# EAGLE design Schaltplan (EAGLE 5.10)
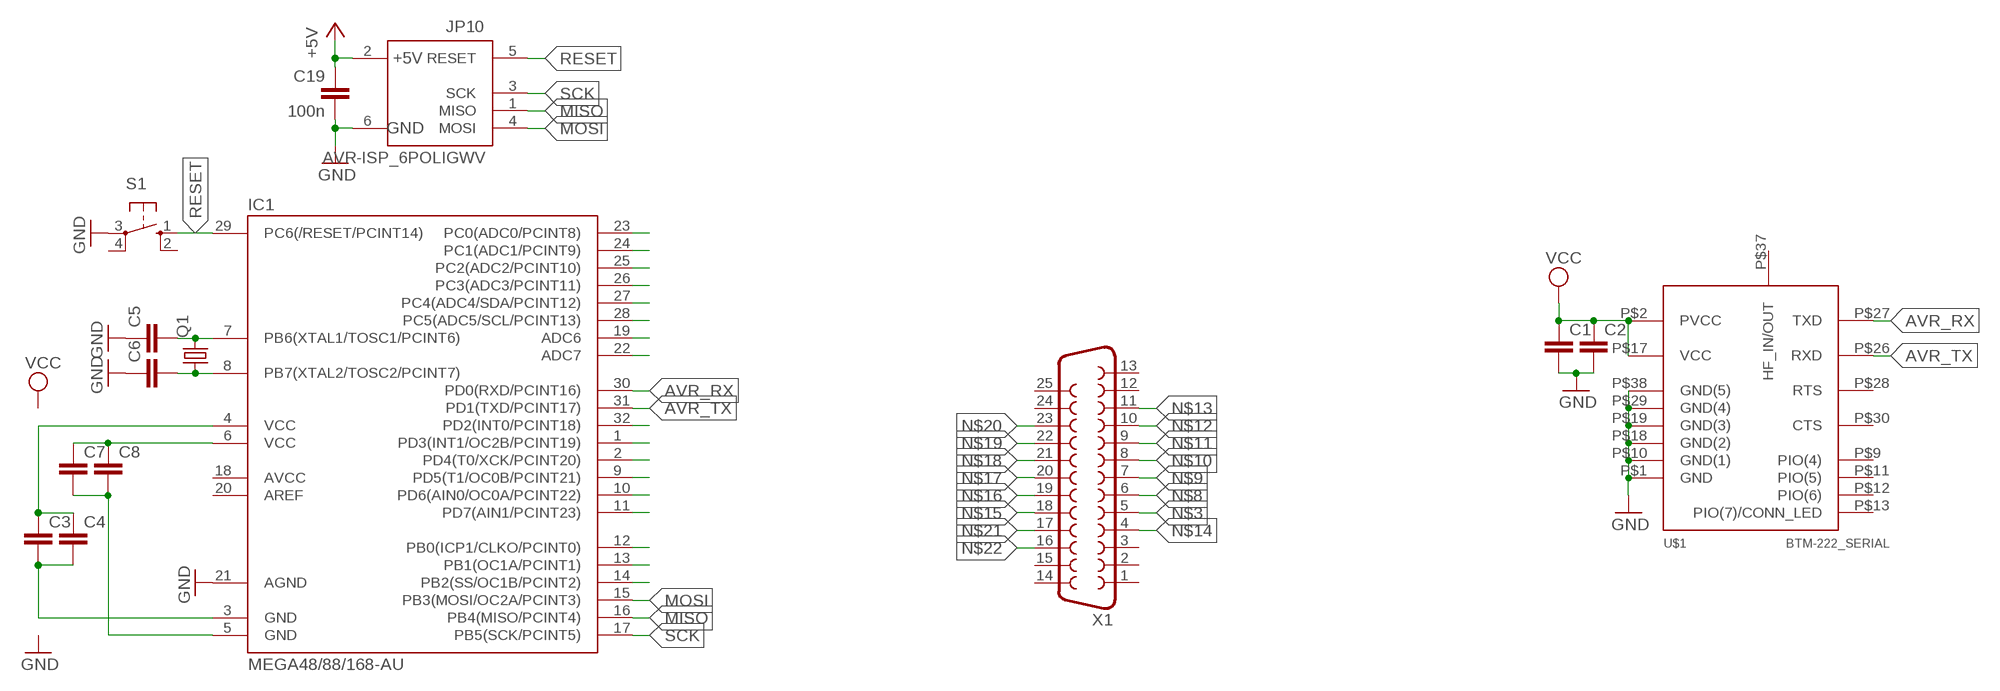
[diagram p0: schematic, sheet 1]

## Parts
C1  C-EUC0805  [C0805]
C2  C-EUC0805  [C0805]
C3  C-EUC0805  [C0805]
C4  C-EUC0805  [C0805]
C5  C-EUC0805  [C0805]
C6  C-EUC0805  [C0805]
C7  C-EUC0805  [C0805]
C8  C-EUC0805  [C0805]
C19  100n  C-EU025-024X044  [C025-024X044]
IC1  MEGA48/88/168-AU  [TQFP32-08]
JP10  AVR-ISP_6POLIGWV  [ML6L]
Q1  CRYSTALHC49U-V  [HC49U-V]
S1  10-XX  [B3F-10XX]
U$1  BTM-222_SERIAL  [BTM-222]
X1  F25VP  [F25VP]

## Nets
+5V: C19.1 JP10.2(+5V)
AVR_RX: IC1.30(PD0(RXD/PCINT16)) U$1.P$27(TXD)
AVR_TX: IC1.31(PD1(TXD/PCINT17)) U$1.P$26(RXD)
GND: C1.2 C2.2 C5.1 C6.1 C19.2 IC1.21(AGND) JP10.6(GND) S1.3(P) U$1.P$1(GND) U$1.P$10(GND(1)) U$1.P$18(GND(2)) U$1.P$19(GND(3)) U$1.P$29(GND(4)) U$1.P$38(GND(5))
MISO: IC1.16(PB4(MISO/PCINT4)) JP10.1(MISO)
MOSI: IC1.15(PB3(MOSI/OC2A/PCINT3)) JP10.4(MOSI)
N$1: C5.2 IC1.7(PB6(XTAL1/TOSC1/PCINT6)) Q1.2
N$2: C6.2 IC1.8(PB7(XTAL2/TOSC2/PCINT7)) Q1.1
N$3: X1.5
N$4: C7.2 C8.2 IC1.5(GND)
N$5: C7.1 C8.1 IC1.6(VCC)
N$6: C3.2 C4.2 IC1.3(GND)
N$7: C3.1 C4.1 IC1.4(VCC)
N$8: X1.6
N$9: X1.7
N$10: X1.8
N$11: X1.9
N$12: X1.10
N$13: X1.11
N$14: X1.4
N$15: X1.18
N$16: X1.19
N$17: X1.20
N$18: X1.21
N$19: X1.22
N$20: X1.23
N$21: X1.17
N$22: X1.16
N$23: IC1.23(PC0(ADC0/PCINT8))
N$24: IC1.24(PC1(ADC1/PCINT9))
N$25: IC1.25(PC2(ADC2/PCINT10))
N$26: IC1.26(PC3(ADC3/PCINT11))
N$27: IC1.27(PC4(ADC4/SDA/PCINT12))
N$28: IC1.28(PC5(ADC5/SCL/PCINT13))
N$29: IC1.19(ADC6)
N$30: IC1.22(ADC7)
N$31: IC1.32(PD2(INT0/PCINT18))
N$32: IC1.1(PD3(INT1/OC2B/PCINT19))
N$33: IC1.2(PD4(T0/XCK/PCINT20))
N$34: IC1.9(PD5(T1/OC0B/PCINT21))
N$35: IC1.10(PD6(AIN0/OC0A/PCINT22))
N$36: IC1.11(PD7(AIN1/PCINT23))
N$37: IC1.12(PB0(ICP1/CLKO/PCINT0))
N$38: IC1.13(PB1(OC1A/PCINT1))
N$39: IC1.14(PB2(SS/OC1B/PCINT2))
RESET: IC1.29(PC6(/RESET/PCINT14)) JP10.5(RESET) S1.1(S)
SCK: IC1.17(PB5(SCK/PCINT5)) JP10.3(SCK)
VCC: C1.1 C2.1 U$1.P$2(PVCC) U$1.P$17(VCC)
Unconnected: IC1.18(AVCC) IC1.20(AREF) S1.2(S1) S1.4(P1) U$1.P$9(PIO(4)) U$1.P$11(PIO(5)) U$1.P$12(PIO(6)) U$1.P$13(PIO(7)/CONN_LED) U$1.P$28(RTS) U$1.P$30(CTS) U$1.P$37(HF_IN/OUT) X1.1 X1.2 X1.3 X1.12 X1.13 X1.14 X1.15 X1.24 X1.25

## Library data of the parts
C1-C8 C19 = rcl:C-EU: CAPACITOR, European symbol
IC1 = avr-6:MEGA48/88/168
JP10 = rca_stecker:AVR-ISP_6POLIG: ISP (In System Programming) Stecker für AVRs Über diesen Anschluß kann ein AVR mit einem Standard ISP-Kabel direkt an einen Parallelport des PC´s angeschlossen und programmiert werden.
Q1 = crystal:CRYSTAL: CRYSTAL
S1 = switch-omron:10-XX: OMRON SWITCH
U$1 = btm_222:BTM-222_SERIAL
X1 = con-subd:F25: SUB-D

## Board
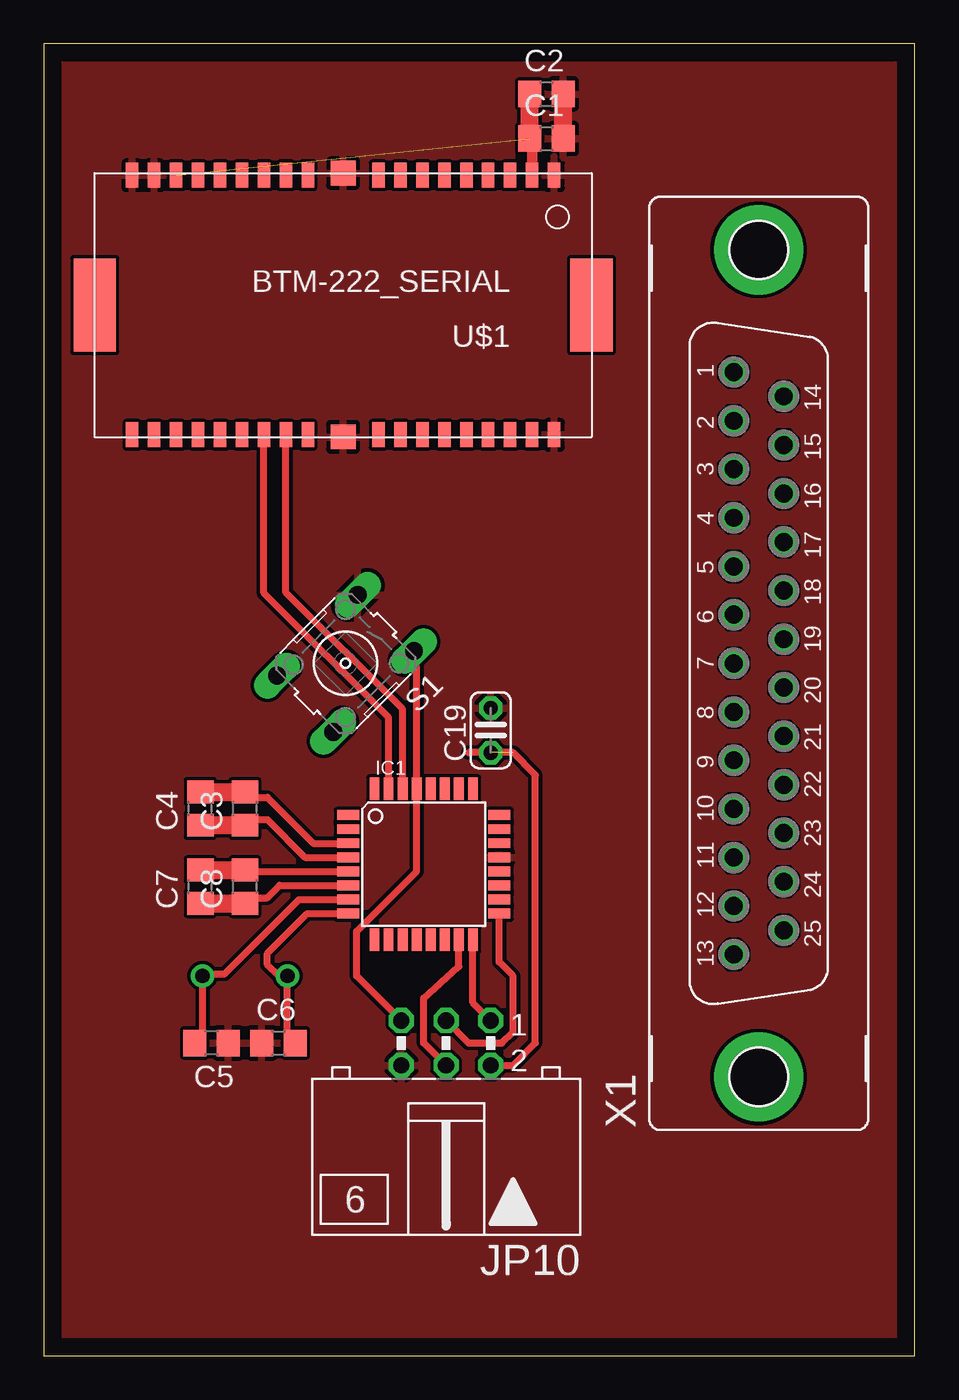
[diagram p1: board, top side]
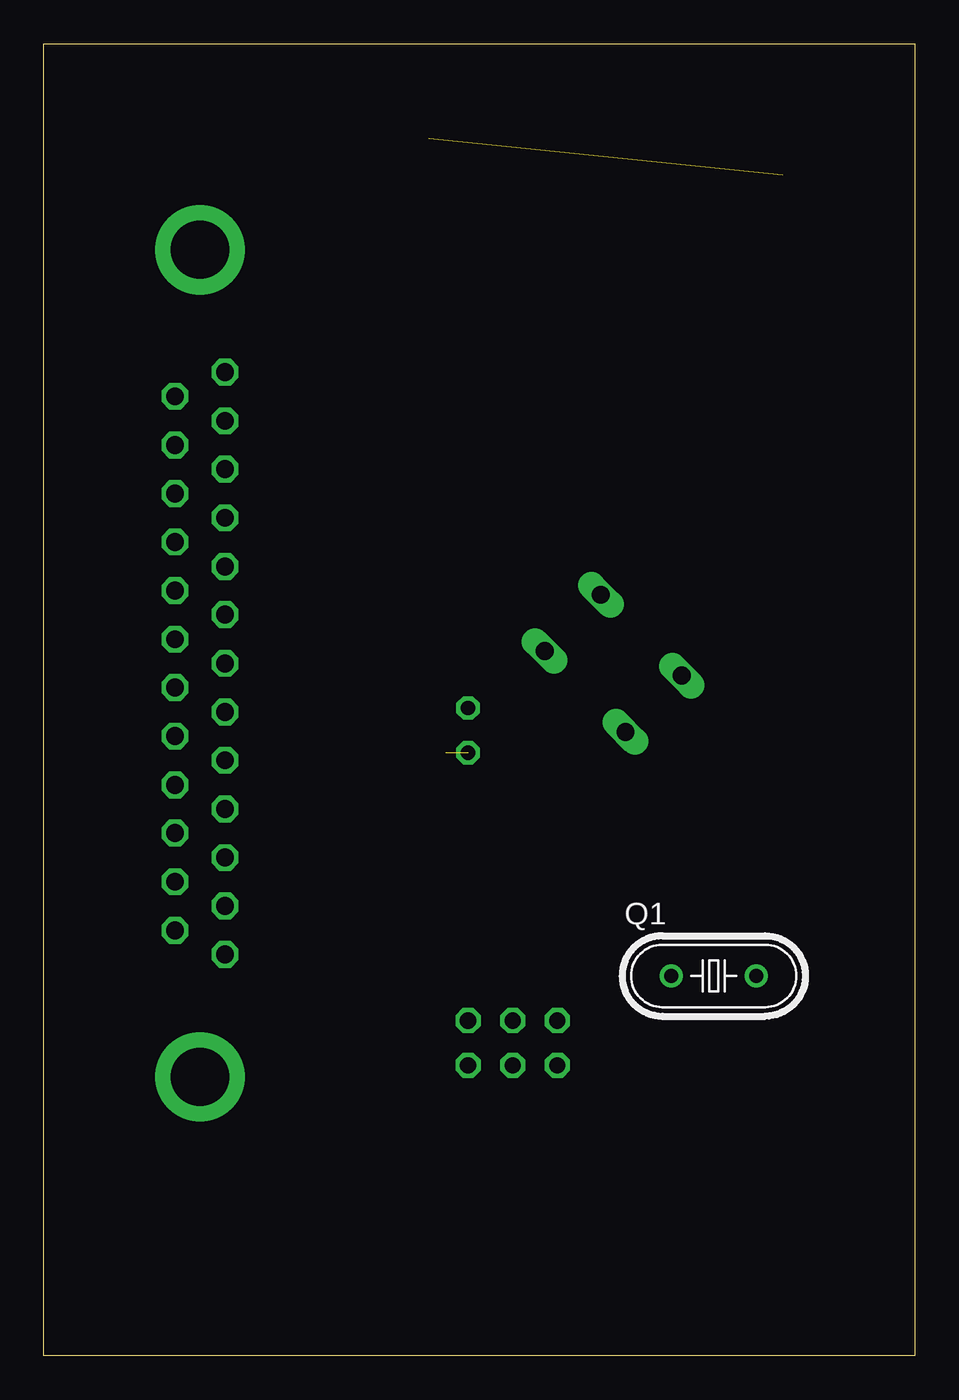
[diagram p2: board, bottom side, seen from below]

Size 49.51 x 74.6 mm. Coordinates in mm from the lower left corner, seen from the top.
Outline: 0,0 49.51,0 49.51,74.6 0,74.6 0,0
Copper layers (1*16): Top 0.035mm / dielectric 1.5mm / Bottom 0.035mm
Design rules "default": minimum track width 10mil, minimum drill 24mil, track to track 8mil, track to pad 8mil, pad to pad 8mil, via to via 8mil, smd to smd 8mil, copper to edge 40mil, drill to drill 8mil, minimum pad ring 10mil, minimum via ring 8mil, stop-mask expansion 4mil, vias tented up to drill 0mil, thermal gap 10mil

### Footprints (pad centres in the part's own frame; a part is rotated, then mirrored left to right if it is on the bottom)
C0805 = smd 1.3 x 1.5: 1 -0.95,0; 2 0.95,0
C025-024X044 = drill 0.813 octagon: 1 -1.27,0; 2 1.27,0
TQFP32-08 = smd 1.27 x 0.559: 1 -4.293,2.8; 2 -4.293,2; 3 -4.293,1.2; 4 -4.293,0.4; 5 -4.293,-0.4; 6 -4.293,-1.2; 7 -4.293,-2; 8 -4.293,-2.8; 17 4.293,-2.8; 18 4.293,-2; 19 4.293,-1.2; 20 4.293,-0.4; 21 4.293,0.4; 22 4.293,1.2; 23 4.293,2; 24 4.293,2.8 | smd 0.559 x 1.27: 9 -2.8,-4.293; 10 -2,-4.293; 11 -1.2,-4.293; 12 -0.4,-4.293; 13 0.4,-4.293; 14 1.2,-4.293; 15 2,-4.293; 16 2.8,-4.293; 25 2.8,4.293; 26 2,4.293; 27 1.2,4.293; 28 0.4,4.293; 29 -0.4,4.293; 30 -1.2,4.293; 31 -2,4.293; 32 -2.8,4.293
ML6L = drill 0.914 octagon: 1 -2.54,-1.27; 2 -2.54,1.27; 3 0,-1.27; 4 0,1.27; 5 2.54,-1.27; 6 2.54,1.27
HC49U-V = drill 0.813 round: 1 -2.413,0; 2 2.413,0
B3F-10XX = drill 1.016 long: 1 -3.251,2.261; 2 3.251,2.261; 3 -3.251,-2.261; 4 3.251,-2.261
BTM-222 = smd 2.4 x 5.3: $AGND -14.625,3.75; $BGND 13.625,3.75 | smd 0.711 x 1.422: P$1 -12.5,-3.625; P$2 -11.25,-3.625; P$3 -10,-3.625; P$4 -8.75,-3.625; P$5 -7.5,-3.625; P$6 -6.25,-3.625; P$7 -5,-3.625; P$8 -3.75,-3.625; P$9 -2.5,-3.625; P$11 1.5,-3.625; P$12 2.75,-3.625; P$13 4,-3.625; P$14 5.25,-3.625; P$15 6.5,-3.625; P$16 7.75,-3.625; P$17 9,-3.625; P$18 10.25,-3.625; P$19 11.5,-3.625; P$20 11.5,11.125; P$21 10.25,11.125; P$22 9,11.125; P$23 7.75,11.125; P$24 6.5,11.125; P$25 5.25,11.125; P$26 4,11.125; P$27 2.75,11.125; P$28 1.5,11.125; P$30 -2.5,11.125; P$31 -3.75,11.125; P$32 -5,11.125; P$33 -6.25,11.125; P$34 -7.5,11.125; P$35 -8.75,11.125; P$36 -10,11.125; P$37 -11.25,11.125; P$38 -12.5,11.125 | smd 1.422 x 1.4: P$10 -0.5,-3.75; P$29 -0.5,11.25
F25VP = drill 1.016 octagon: 1 16.561,1.422; 2 13.792,1.422; 3 11.049,1.422; 4 8.28,1.422; 5 5.512,1.422; 6 2.769,1.422; 7 0,1.422; 8 -2.769,1.422; 9 -5.512,1.422; 10 -8.28,1.422; 11 -11.049,1.422; 12 -13.792,1.422; 13 -16.561,1.422; 14 15.189,-1.422; 15 12.421,-1.422; 16 9.652,-1.422; 17 6.909,-1.422; 18 4.14,-1.422; 19 1.372,-1.422; 20 -1.372,-1.422; 21 -4.14,-1.422; 22 -6.909,-1.422; 23 -9.652,-1.422; 24 -12.421,-1.422; 25 -15.189,-1.422 | drill 3.302 pad 5.08 round: G1 -23.52,0; G2 23.52,0

### Placement (x,y rotation side)
C1  28.57,69.22 0 top
C2  28.57,71.75 0 top
C3  11.43,31.11 90 top
C4  8.89,31.11 90 top
C5  9.53,17.78 180 top
C6  13.34,17.78 0 top
C7  8.89,26.67 90 top
C8  11.43,26.67 90 top
C19  25.4,35.56 90 top
IC1  21.59,27.94 0 top
JP10  22.86,17.78 180 top
Q1  11.43,21.59 0 bottom
S1  17.14,39.37 225 top
U$1  16.51,63.5 180 top
X1  40.64,39.37 90 top

### Tracks (layer width: path | path; a pad name or v marks a point on that pad's centre or on a via)
+5V  (1 unrouted)
  Top 0.406: JP10.2 26.67,16.51 27.94,17.78 27.94,33.02 26.67,34.29 24.13,34.29
AVR_RX
  Top 0.406: U$1.P$27 13.76,43.39 20.39,36.76 IC1.30
AVR_TX
  Top 0.406: IC1.31 19.59,36.29 12.51,43.37 U$1.P$26
GND
  Top 1.016: C1.2 C2.2
  pour Top: 0,74.93 49.53,74.93 49.53,0 0,0
MISO
  Top 0.406: IC1.16 24.39,20.06 JP10.1
MOSI
  Top 0.406: IC1.15 23.59,22.13 21.59,20.32 21.59,17.78 JP10.4
N$1
  Top 0.406: IC1.7 14.51,25.94 10.29,21.72 8.89,21.72 Q1.2 9.02,18.22 C5.2
N$2
  Top 0.406: IC1.8 14.98,25.14 12.7,22.86 12.7,22.23 13.34,21.59 13.97,21.72 Q1.1 13.84,18.22 C6.2
N$4
  Top 0.406: IC1.5 11.51,27.54 C8.2
  Top 1.016: C7.2 C8.2
N$5
  Top 0.406: IC1.6 13.4,26.74 12.7,26.04 11.74,26.04 C8.1
  Top 1.016: C7.1 C8.1
N$6
  Top 0.406: IC1.3 15.31,29.14 12.7,31.75 11.74,31.75 C3.2
  Top 1.016: C4.2 C3.2
N$7
  Top 0.406: IC1.4 14.84,28.34 12.7,30.48 11.74,30.48 C3.1
  Top 1.016: C4.1 C3.1
RESET
  Top 0.406: JP10.5 17.78,21.59 17.78,24.13 21.19,27.54 IC1.29 21.19,39.13 20.32,40.01 S1.1
SCK
  Top 0.406: JP10.3 24.13,17.78 26.04,17.78 26.67,18.41 26.67,21.59 25.88,22.38 IC1.17
VCC  (1 unrouted)
  Top 0.61: U$1.P$2 27.76,69.08 C1.1
  Top 1.016: C1.1 C2.1